# EAGLE design unonano (EAGLE 9.3.0)
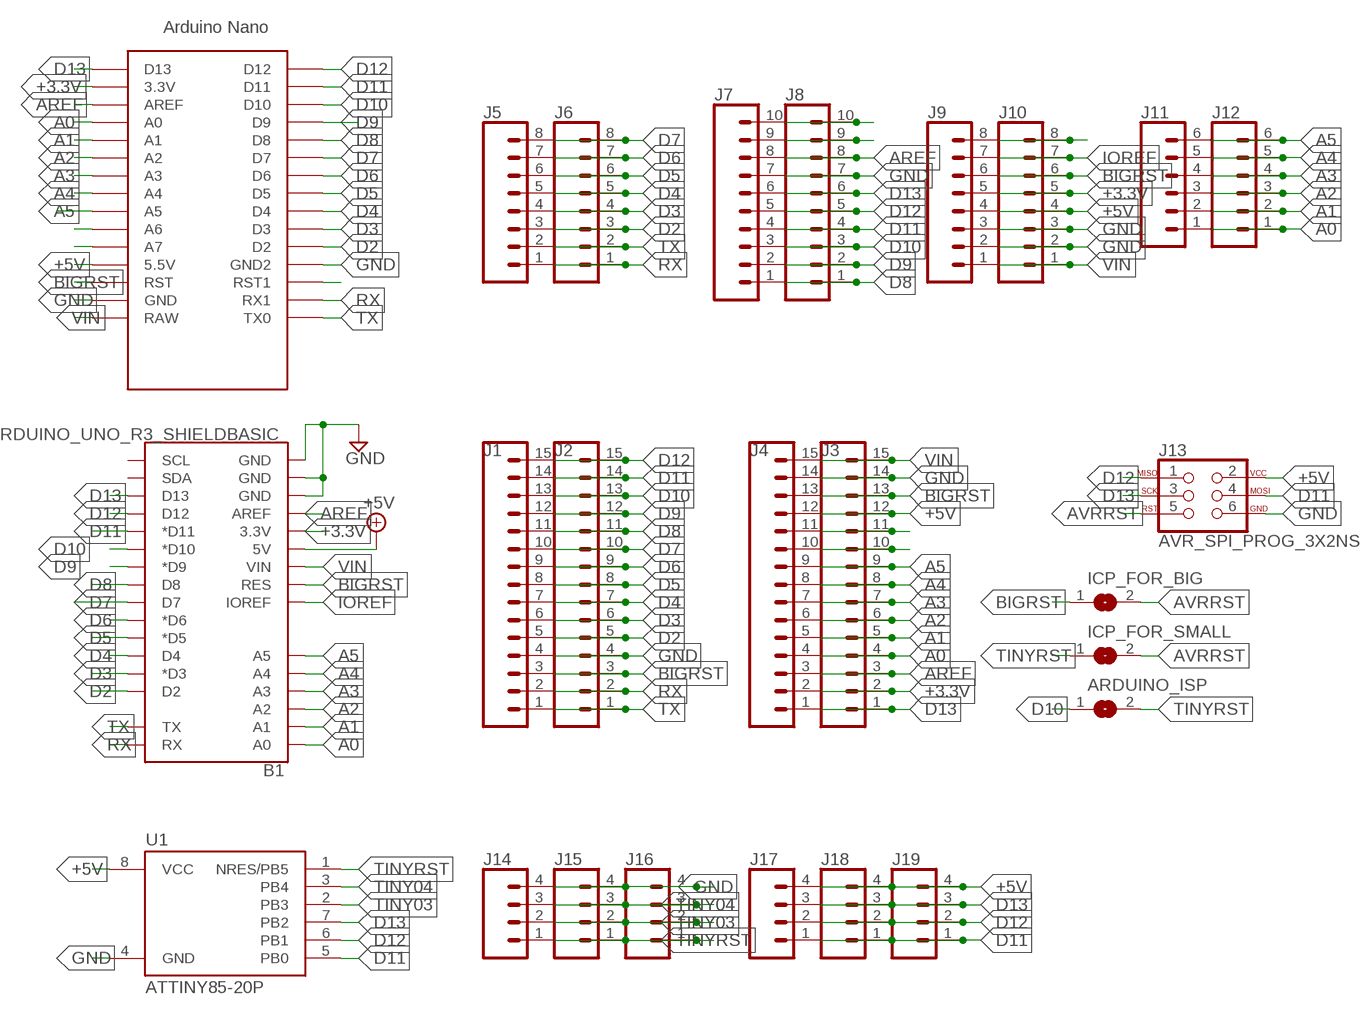
[diagram p0: schematic, sheet 1]

## Parts
ARDUINO_ISP  SJ  [SJ]
B1  ARDUINO_UNO_R3_SHIELDBASIC  [UNO_R3_SHIELD]
ICP_FOR_BIG  SJ  [SJ]
ICP_FOR_SMALL  SJ  [SJ]
J1  CONN_15  [1X15]
J2  CONN_15  [1X15]
J3  CONN_15  [1X15]
J4  CONN_15  [1X15]
J5  CONN_08"  [1X08]
J6  CONN_08"  [1X08]
J7  CONN_10"  [1X10]
J8  CONN_10"  [1X10]
J9  CONN_08"  [1X08]
J10  CONN_08"  [1X08]
J11  CONN_06SILK_FEMALE_PTH  [1X06]
J12  CONN_06SILK_FEMALE_PTH  [1X06]
J13  AVR_SPI_PROG_3X2NS  [2X3-NS]
J14  CONN_04  [1X04]
J15  CONN_04  [1X04]
J16  CONN_04  [1X04]
J17  CONN_04  [1X04]
J18  CONN_04  [1X04]
J19  CONN_04  [1X04]
U1  ATTINY85-20P  [PDIP08_300MIL]
U$1  NANO  [NANO]

## Nets
+3.3V: B1.3.3V J3.2 J4.2 J9.5 J10.5 U$1.3.3V
+5V: B1.5V J3.12 J4.12 J9.4 J10.4 J13.2 J17.4 J18.4 J19.4 U1.8(VCC) U$1.5V(5.5V)
A0: B1.A0 J3.4 J4.4 J11.1 J12.1 U$1.A0
A1: B1.A1 J3.5 J4.5 J11.2 J12.2 U$1.A1
A2: B1.A2 J3.6 J4.6 J11.3 J12.3 U$1.A2
A3: B1.A3 J3.7 J4.7 J11.4 J12.4 U$1.A3
A4: B1.A4 J3.8 J4.8 J11.5 J12.5 U$1.A4
A5: B1.A5 J3.9 J4.9 J11.6 J12.6 U$1.A5
AREF: B1.AREF J3.3 J4.3 J7.8 J8.8 U$1.AREF
AVRRST: ICP_FOR_BIG.2 ICP_FOR_SMALL.2 J13.5
BIGRST: B1.RES ICP_FOR_BIG.1 J1.3 J2.3 J3.13 J4.13 J9.6 J10.6 U$1.RST
D2: B1.D2 J1.5 J2.5 J5.3 J6.3 U$1.D2
D3: B1.D3(*D3) J1.6 J2.6 J5.4 J6.4 U$1.D3
D4: B1.D4 J1.7 J2.7 J5.5 J6.5 U$1.D4
D5: B1.D5(*D5) J1.8 J2.8 J5.6 J6.6 U$1.D5
D6: B1.D6(*D6) J1.9 J2.9 J5.7 J6.7 U$1.D6
D7: B1.D7 J1.10 J2.10 J5.8 J6.8 U$1.D7
D8: B1.D8 J1.11 J2.11 J7.1 J8.1 U$1.D8
D9: B1.D9(*D9) J1.12 J2.12 J7.2 J8.2 U$1.D9
D10: ARDUINO_ISP.1 B1.D10(*D10) J1.13 J2.13 J7.3 J8.3 U$1.D10
D11: B1.D11(*D11) J1.14 J2.14 J7.4 J8.4 J13.4 J17.1 J18.1 J19.1 U1.5(PB0) U$1.D11
D12: B1.D12 J1.15 J2.15 J7.5 J8.5 J13.1 J17.2 J18.2 J19.2 U1.6(PB1) U$1.D12
D13: B1.D13 J3.1 J4.1 J7.6 J8.6 J13.3 J17.3 J18.3 J19.3 U1.7(PB2) U$1.D13
GND: B1.GND@0(GND) B1.GND@1(GND) B1.GND@2(GND) J1.4 J2.4 J3.14 J4.14 J7.7 J8.7 J9.2 J9.3 J10.2 J10.3 J13.6 J14.4 J15.4 J16.4 U1.4(GND) U$1.GND U$1.GND1(GND2)
IOREF: B1.IOREF J9.7 J10.7
N$1: J9.8 J10.8
N$5: J3.11 J4.11
N$6: J3.10 J4.10
N$11: U$1.A6
N$12: U$1.A7
N$14: J7.9 J8.9
N$15: J7.10 J8.10
N$21: U$1.RST1
RX: B1.RX J1.2 J2.2 J5.1 J6.1 U$1.RX1
TINY03: J14.2 J15.2 J16.2 U1.2(PB3)
TINY04: J14.3 J15.3 J16.3 U1.3(PB4)
TINYRST: ARDUINO_ISP.2 ICP_FOR_SMALL.1 J14.1 J15.1 J16.1 U1.1(NRES/PB5)
TX: B1.TX J1.1 J2.1 J5.2 J6.2 U$1.TX0
VIN: B1.VIN J3.15 J4.15 J9.1 J10.1 U$1.RAW
Unconnected: B1.SCL B1.SDA U$1.ICSP1 U$1.ICSP2 U$1.ICSP3 U$1.ICSP4 U$1.ICSP5 U$1.ICSP6

## Library data of the parts
ARDUINO_ISP ICP_FOR_BIG ICP_FOR_SMALL = jumper:SJ: SMD solder JUMPER
B1 = SparkFun-Boards:ARDUINO_UNO_R3_SHIELD: Arduino R3 Shield Footprint Shield form compatible with the Arduino Uno R3. SparkFun Products: MG2639 Cellular Shield <https://www.sparkfun.com/products/13120> MIDI Shield <https://www.sparkfun.com/products/12898> R3 Stackable Headers Kit <https://www.sparkfun.com/products/11417>
J1-J4 = SparkFun-Connectors:CONN_15: Multi connection point. Often used as Generic Header-pin footprint for 0.1 inch spaced/style header connections On any of the 0.1 inch spaced packages, you can populate with these: Break Away Headers - Straight <https://www.sparkfun.com/products/116> (PRT-00116) Break Away Male Headers - Right Angle <https://www.sparkfun.com/products/553> (PRT-00553) Female Headers <https://www.sparkfun.com/products/115> (PRT-00115) Break Away Headers - Machine Pin <https://www.sparkfun.com/products/117> (PRT-00117) Break Away Female Headers - Swiss Machine Pin <https://www.sparkfun.com/products/743> (PRT-00743) For SCREWTERMINALS and SPRING TERMINALS visit here: Screw Terimnals on SparkFun.com <https://www.sparkfun.com/search/results?term=Screw+Terminals> (5mm/3.5mm/2.54mm spacing) This device is also useful as a general connection point to wire up your design to another part of your project. Our various solder wires solder well into these plated through hole pads. Hook-Up Wire - Assortment (Stranded, 22 AWG) <https://www.sparkfun.com/products/11375> (PRT-11375) Hook-Up Wire - Assortment (Solid Core, 22 AWG) <https://www.sparkfun.com/products/11367> (PRT-11367) View the entire wire category on our website here <https://www.sparkfun.com/categories/141> Special notes: Molex polarized connector foot print use with SKU : PRT-08231 with associated crimp pins and housings. 1MM SMD Version SKU: PRT-10208 NOTES ON THE VARIANTS LOCK and LOCK_LONGPADS... This footprint was designed to help hold the alignment of a through-hole component (i.e. 6-pin header) while soldering it into place. You may notice that each hole has been shifted either up or down by 0.005 of an inch from it's more standard position (which is a perfectly straight line). This slight alteration caused the pins (the squares in the middle) to touch the edges of the holes. Because they are alternating, it causes a "brace" to hold the component in place. 0.005 has proven to be the perfect amount of "off-center" position when using our standard breakaway headers. Although looks a little odd when you look at the bare footprint, once you have a header in there, the alteration is very hard to notice. Also,if you push a header all the way into place, it is covered up entirely on the bottom side.
J5 J6 J9 J10 = SparkFun-Connectors:CONN_08: Multi connection point. Often used as Generic Header-pin footprint for 0.1 inch spaced/style header connections On any of the 0.1 inch spaced packages, you can populate with these: Break Away Headers - Straight <https://www.sparkfun.com/products/116> (PRT-00116) Break Away Male Headers - Right Angle <https://www.sparkfun.com/products/553> (PRT-00553) Female Headers <https://www.sparkfun.com/products/115> (PRT-00115) Break Away Headers - Machine Pin <https://www.sparkfun.com/products/117> (PRT-00117) Break Away Female Headers - Swiss Machine Pin <https://www.sparkfun.com/products/743> (PRT-00743) Arduino Stackable Header - 8 Pin <https://www.sparkfun.com/products/9279> (PRT-09279) For SCREWTERMINALS and SPRING TERMINALS visit here: Screw Terimnals on SparkFun.com <https://www.sparkfun.com/search/results?term=Screw+Terminals> (5mm/3.5mm/2.54mm spacing) This device is also useful as a general connection point to wire up your design to another part of your project. Our various solder wires solder well into these plated through hole pads. Hook-Up Wire - Assortment (Stranded, 22 AWG) <https://www.sparkfun.com/products/11375> (PRT-11375) Hook-Up Wire - Assortment (Solid Core, 22 AWG) <https://www.sparkfun.com/products/11367> (PRT-11367) View the entire wire category on our website here <https://www.sparkfun.com/categories/141> Special notes: Molex polarized connector foot print use with SKU : PRT-08231 with associated crimp pins and housings. 1MM SMD Version SKU: PRT-10208 NOTES ON THE VARIANTS LOCK and LOCK_LONGPADS... This footprint was designed to help hold the alignment of a through-hole component (i.e. 6-pin header) while soldering it into place. You may notice that each hole has been shifted either up or down by 0.005 of an inch from it's more standard position (which is a perfectly straight line). This slight alteration caused the pins (the squares in the middle) to touch the edges of the holes. Because they are alternating, it causes a "brace" to hold the component in place. 0.005 has proven to be the perfect amount of "off-center" position when using our standard breakaway headers. Although looks a little odd when you look at the bare footprint, once you have a header in there, the alteration is very hard to notice. Also,if you push a header all the way into place, it is covered up entirely on the bottom side.; PROD_ID: CONN-08438
J7 J8 = SparkFun-Connectors:CONN_10: Multi connection point. Often used as Generic Header-pin footprint for 0.1 inch spaced/style header connections On any of the 0.1 inch spaced packages, you can populate with these: Break Away Headers - Straight <https://www.sparkfun.com/products/116> (PRT-00116) Break Away Male Headers - Right Angle <https://www.sparkfun.com/products/553> (PRT-00553) Female Headers <https://www.sparkfun.com/products/115> (PRT-00115) Break Away Headers - Machine Pin <https://www.sparkfun.com/products/117> (PRT-00117) Break Away Female Headers - Swiss Machine Pin <https://www.sparkfun.com/products/743> (PRT-00743) Arduino Stackable Header - 10 Pin <https://www.sparkfun.com/products/11376> (PRT-11376) For SCREWTERMINALS and SPRING TERMINALS visit here: Screw Terimnals on SparkFun.com <https://www.sparkfun.com/search/results?term=Screw+Terminals> (5mm/3.5mm/2.54mm spacing) This device is also useful as a general connection point to wire up your design to another part of your project. Our various solder wires solder well into these plated through hole pads. Hook-Up Wire - Assortment (Stranded, 22 AWG) <https://www.sparkfun.com/products/11375> (PRT-11375) Hook-Up Wire - Assortment (Solid Core, 22 AWG) <https://www.sparkfun.com/products/11367> (PRT-11367) View the entire wire category on our website here <https://www.sparkfun.com/categories/141> Special notes: Molex polarized connector foot print use with SKU : PRT-08231 with associated crimp pins and housings. 1MM SMD Version SKU: PRT-10208 NOTES ON THE VARIANTS LOCK and LOCK_LONGPADS... This footprint was designed to help hold the alignment of a through-hole component (i.e. 6-pin header) while soldering it into place. You may notice that each hole has been shifted either up or down by 0.005 of an inch from it's more standard position (which is a perfectly straight line). This slight alteration caused the pins (the squares in the middle) to touch the edges of the holes. Because they are alternating, it causes a "brace" to hold the component in place. 0.005 has proven to be the perfect amount of "off-center" position when using our standard breakaway headers. Although looks a little odd when you look at the bare footprint, once you have a header in there, the alteration is very hard to notice. Also,if you push a header all the way into place, it is covered up entirely on the bottom side.; PROD_ID: CONN-11563
J11 J12 = SparkFun-Connectors:CONN_06: Multi connection point. Often used as Generic Header-pin footprint for 0.1 inch spaced/style header connections On any of the 0.1 inch spaced packages, you can populate with these: Break Away Headers - Straight <https://www.sparkfun.com/products/116> (PRT-00116) Break Away Male Headers - Right Angle <https://www.sparkfun.com/products/553> (PRT-00553) Female Headers <https://www.sparkfun.com/products/115> (PRT-00115) Break Away Headers - Machine Pin <https://www.sparkfun.com/products/117> (PRT-00117) Break Away Female Headers - Swiss Machine Pin <https://www.sparkfun.com/products/743> (PRT-00743) Arduino Stackable Header - 6 Pin <https://www.sparkfun.com/products/9280> (PRT-09280) For SCREWTERMINALS and SPRING TERMINALS visit here: Screw Terimnals on SparkFun.com <https://www.sparkfun.com/search/results?term=Screw+Terminals> (5mm/3.5mm/2.54mm spacing) This device is also useful as a general connection point to wire up your design to another part of your project. Our various solder wires solder well into these plated through hole pads. Hook-Up Wire - Assortment (Stranded, 22 AWG) <https://www.sparkfun.com/products/11375> (PRT-11375) Hook-Up Wire - Assortment (Solid Core, 22 AWG) <https://www.sparkfun.com/products/11367> (PRT-11367) View the entire wire category on our website here <https://www.sparkfun.com/categories/141>; PROD_ID: CONN-08437
J13 = SparkFun-Connectors:AVR_SPI_PROG_3X2: AVR ISP 6 Pin This is the reduced ISP connector for AVR programming. Common on Arduino. This footprint will take up less PCB space and can be used with a 10-pin to 6-pin adapter such as SKU: BOB-08508 **Special note about "TEST_POINT" package. The stop mask is on the top side, so if you want your programming test points to be on the bottom of your board, make sure to place this package on the bottom side of the board. This also ensure that the orientation to program from the bottom side will be correct. SparkFun Products: SparkFun ISP Pogo Adapter <https://www.sparkfun.com/products/11591> - NS Tiny AVR Programmer <https://www.sparkfun.com/products/11801> -PTH
J14-J19 = SparkFun-Connectors:CONN_04: Multi connection point. Often used as Generic Header-pin footprint for 0.1 inch spaced/style header connections On any of the 0.1 inch spaced packages, you can populate with these: Break Away Headers - Straight <https://www.sparkfun.com/products/116> (PRT-00116) Break Away Male Headers - Right Angle <https://www.sparkfun.com/products/553> (PRT-00553) Female Headers <https://www.sparkfun.com/products/115> (PRT-00115) Break Away Headers - Machine Pin <https://www.sparkfun.com/products/117> (PRT-00117) Break Away Female Headers - Swiss Machine Pin <https://www.sparkfun.com/products/743> (PRT-00743) For SCREWTERMINALS and SPRING TERMINALS visit here: Screw Terimnals on SparkFun.com <https://www.sparkfun.com/search/results?term=Screw+Terminals> (5mm/3.5mm/2.54mm spacing) This device is also useful as a general connection point to wire up your design to another part of your project. Our various solder wires solder well into these plated through hole pads. Hook-Up Wire - Assortment (Stranded, 22 AWG) <https://www.sparkfun.com/products/11375> (PRT-11375) Hook-Up Wire - Assortment (Solid Core, 22 AWG) <https://www.sparkfun.com/products/11367> (PRT-11367) View the entire wire category on our website here <https://www.sparkfun.com/categories/141> Special notes: Molex polarized connector foot print use with SKU : PRT-08231 with associated crimp pins and housings. 1MM SMD Version SKU: PRT-10208; PROD_ID: CONN-09696
U1 = _hhn_attiny25_45_85:ATTINY85*: ATMEL ATtiny 85 Packages: P = PDIP 08 30mil S = SOIC 08 EIAJ 208mil Technologies Note: for complete ordering code (temp. range, finish, tape&reel etc.) see www.atmel.com • Supply Voltage: V = (1.8…5.5)V | [blank] = (2.7…5.5)V • Speed: 10 = 10 MHz | 20 = 20 MHz Author: Dipl.-Ing. FH Rainer Bayer HHN Hochschule Heilbronn (Heilbronn University), rainer.bayer@hs-heilbronn.de Ingenieurbüro ing-rb, mail@ing-rb.de
U$1 = Arduino-clone:NANO: Arduino Nano

## Board
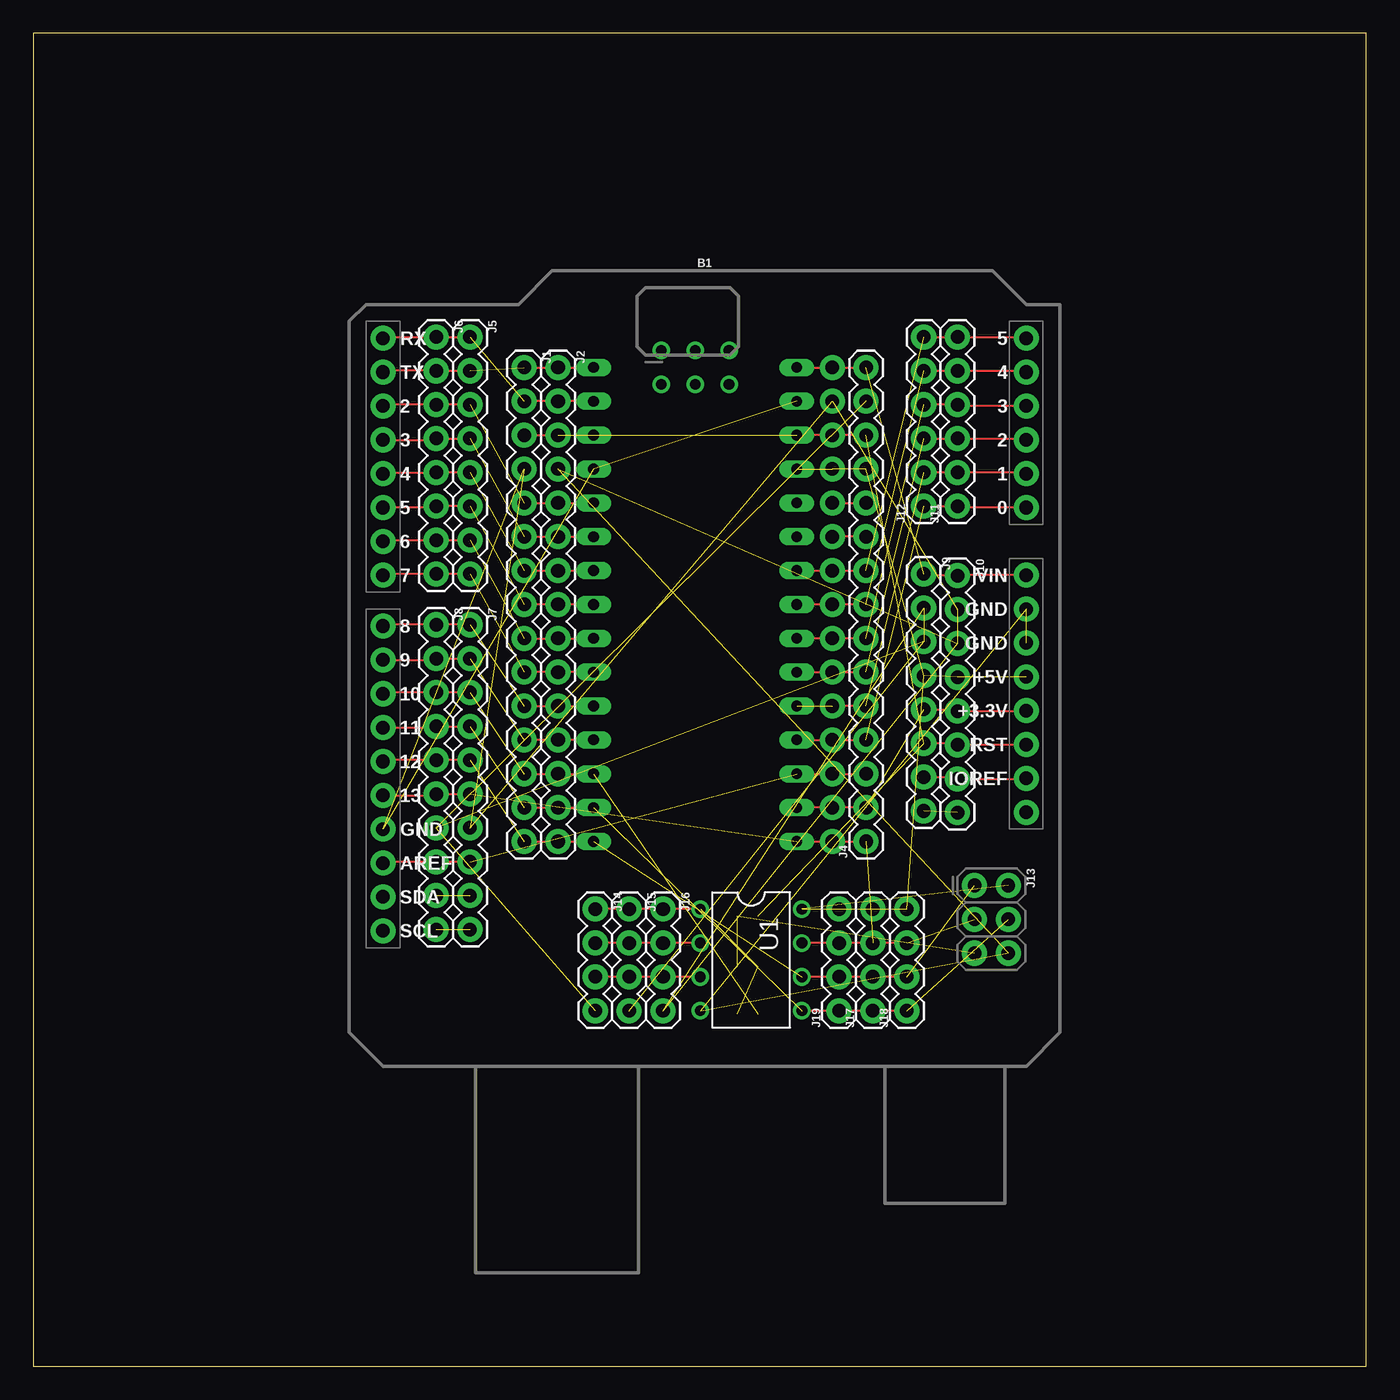
[diagram p1: board, top side]
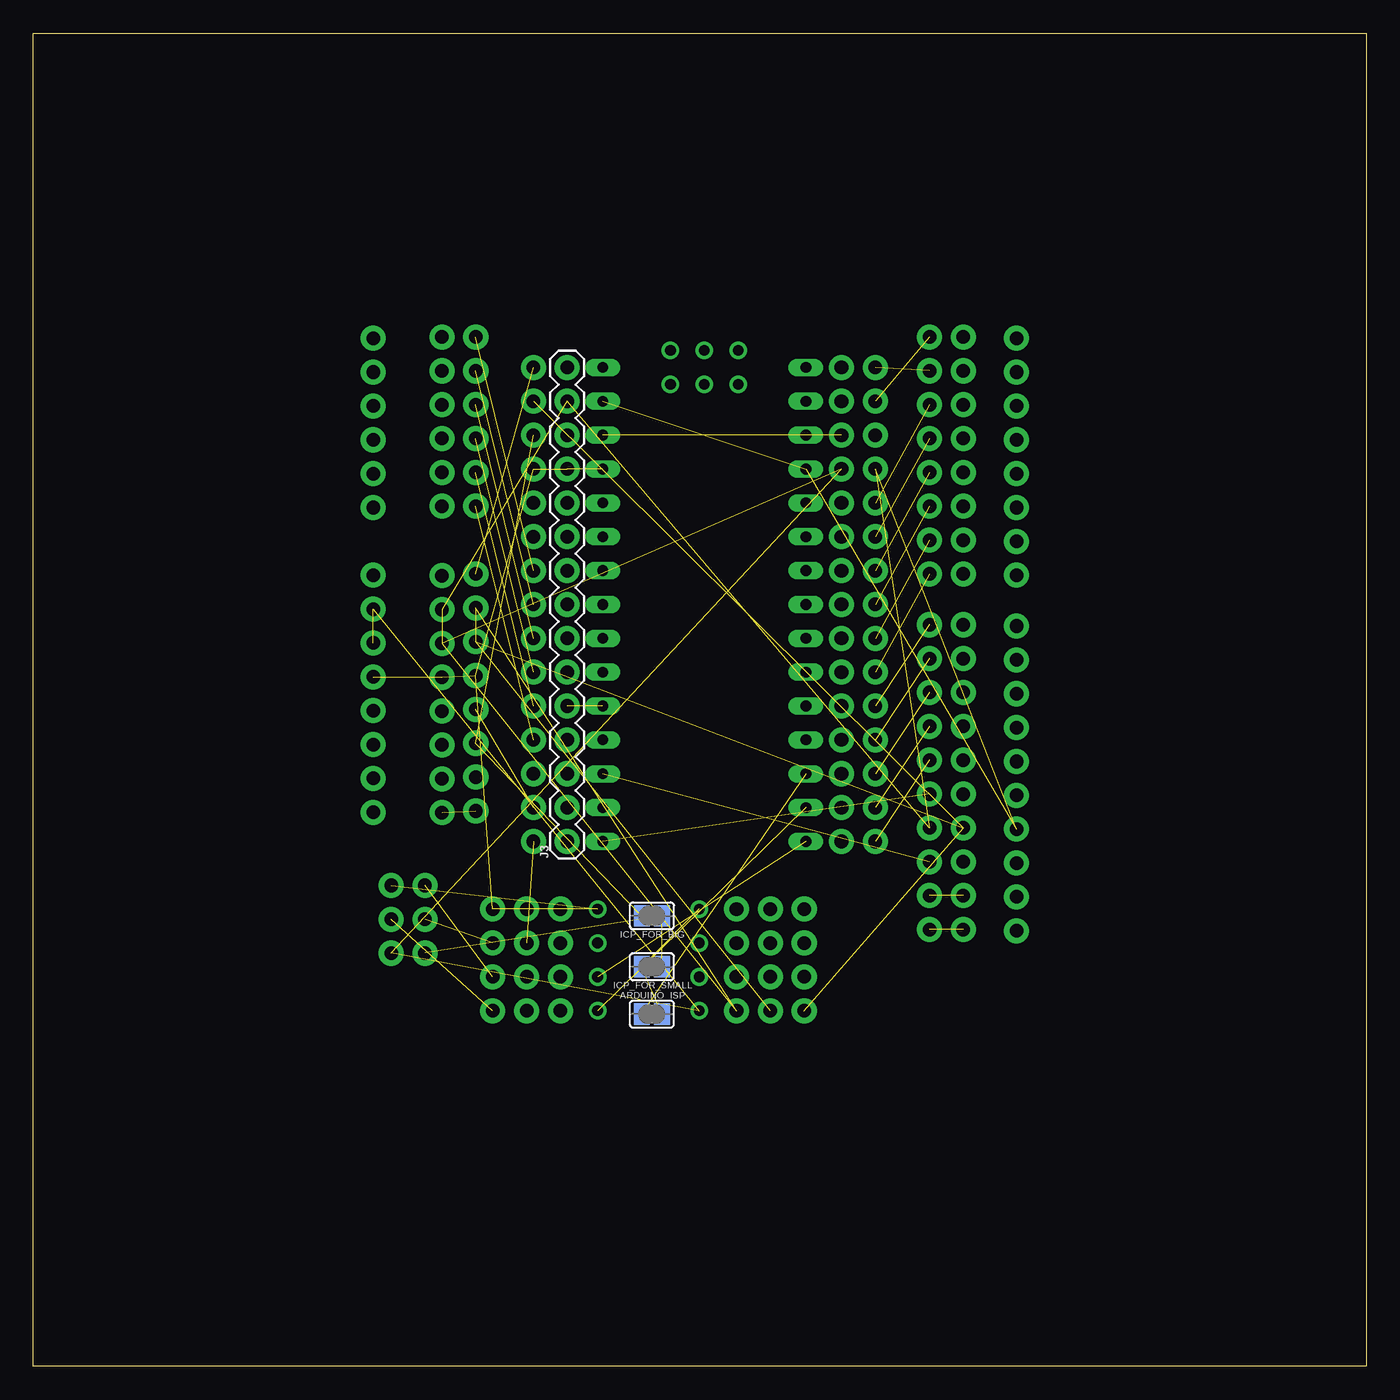
[diagram p2: board, bottom side, seen from below]

Size 100 x 100 mm. Coordinates in mm from the lower left corner, seen from the top.
Outline: 0,0 100,0 100,100 0,100 0,0
Copper layers (1*16): Top 0.035mm / dielectric 1.5mm / Bottom 0.035mm
Design rules "default": minimum track width 6mil, minimum drill 0.35mm, track to track 6mil, track to pad 6mil, pad to pad 6mil, via to via 6mil, smd to smd 6mil, copper to edge 40mil, drill to drill 6mil, minimum pad ring 10mil, minimum via ring 8mil, stop-mask expansion 4mil, vias tented up to drill 0mil, thermal gap 10mil

### Footprints (pad centres in the part's own frame; a part is rotated, then mirrored left to right if it is on the bottom)
SJ = smd 1.168 x 1.6: 1 -0.762,0; 2 0.762,0
UNO_R3_SHIELD = drill 1.016 pad 1.88: 3.3V 24.13,-2.54; 5V 24.13,0; A0 24.13,12.7; A1 24.13,15.24; A2 24.13,17.78; A3 24.13,20.32; A4 24.13,22.86; A5 24.13,25.4; AREF -24.13,-13.97; D2 -24.13,20.32; D3 -24.13,17.78; D4 -24.13,15.24; D5 -24.13,12.7; D6 -24.13,10.16; D7 -24.13,7.62; D8 -24.13,3.81; D9 -24.13,1.27; D10 -24.13,-1.27; D11 -24.13,-3.81; D12 -24.13,-6.35; D13 -24.13,-8.89; GND@0 24.13,2.54; GND@1 24.13,5.08; GND@2 -24.13,-11.43; IOREF 24.13,-7.62; NC 24.13,-10.16; RES 24.13,-5.08; RX -24.13,25.4; SCL -24.13,-19.05; SDA -24.13,-16.51; TX -24.13,22.86; VIN 24.13,7.62
1X15 = drill 1.016 pad 1.88: 1 0,0; 2 2.54,0; 3 5.08,0; 4 7.62,0; 5 10.16,0; 6 12.7,0; 7 15.24,0; 8 17.78,0; 9 20.32,0; 10 22.86,0; 11 25.4,0; 12 27.94,0; 13 30.48,0; 14 33.02,0; 15 35.56,0
1X08 = drill 1.016 pad 1.88: 1 0,0; 2 2.54,0; 3 5.08,0; 4 7.62,0; 5 10.16,0; 6 12.7,0; 7 15.24,0; 8 17.78,0
1X10 = drill 1.016 pad 1.88: 1 0,0; 2 2.54,0; 3 5.08,0; 4 7.62,0; 5 10.16,0; 6 12.7,0; 7 15.24,0; 8 17.78,0; 9 20.32,0; 10 22.86,0
1X06 = drill 1.016 pad 1.88: 1 0,0; 2 2.54,0; 3 5.08,0; 4 7.62,0; 5 10.16,0; 6 12.7,0
2X3-NS = drill 1.016 pad 1.88: 1 -2.54,-1.27; 2 -2.54,1.27; 3 0,-1.27; 4 0,1.27; 5 2.54,-1.27; 6 2.54,1.27
1X04 = drill 1.016 pad 1.88: 1 0,0; 2 2.54,0; 3 5.08,0; 4 7.62,0
PDIP08_300MIL = drill 0.813: 1 -3.81,-3.81; 2 -1.27,-3.81; 3 1.27,-3.81; 4 3.81,-3.81; 5 3.81,3.81; 6 1.27,3.81; 7 -1.27,3.81; 8 -3.81,3.81
NANO = drill 0.8 long: 3.3V -10.16,24.13; 5V -10.16,-1.27; A0 -10.16,19.05; A1 -10.16,16.51; A2 -10.16,13.97; A3 -10.16,11.43; A4 -10.16,8.89; A5 -10.16,6.35; A6 -10.16,3.81; A7 -10.16,1.27; AREF -10.16,21.59; D2 5.08,1.27; D3 5.08,3.81; D4 5.08,6.35; D5 5.08,8.89; D6 5.08,11.43; D7 5.08,13.97; D8 5.08,16.51; D9 5.08,19.05; D10 5.08,21.59; D11 5.08,24.13; D12 5.08,26.67; D13 -10.16,26.67; GND -10.16,-6.35; GND1 5.08,-1.27; RAW -10.16,-8.89; RST -10.16,-3.81; RST1 5.08,-3.81; RX1 5.08,-6.35; TX0 5.08,-8.89 | drill 0.8: ICSP1 -5.08,-10.16; ICSP2 -5.08,-7.62; ICSP3 -2.54,-10.16; ICSP4 -2.54,-7.62; ICSP5 0,-10.16; ICSP6 0,-7.62

### Placement (x,y rotation side)
ARDUINO_ISP  53.59,26.42 0 bottom
B1  50.36,51.72 0 top
ICP_FOR_BIG  53.59,33.78 0 bottom
ICP_FOR_SMALL  53.59,29.97 0 bottom
J1  36.83,74.93 270 top
J2  39.37,74.93 270 top
J3  59.94,39.37 90 bottom
J4  62.48,39.37 90 top
J5  32.77,77.22 270 top
J6  30.23,77.22 270 top
J7  32.77,55.63 270 top
J8  30.23,55.63 270 top
J9  66.8,59.44 270 top
J10  69.34,59.31 270 top
J11  69.34,64.52 90 top
J12  66.8,64.52 90 top
J13  71.88,33.53 270 top
J14  42.16,34.29 270 top
J15  44.7,34.29 270 top
J16  47.24,34.29 270 top
J17  62.99,26.67 90 top
J18  65.53,26.67 90 top
J19  60.45,26.67 90 top
U1  53.85,30.48 270 top
U$1  47.12,66.04 180 top

### Tracks (layer width: path | path; a pad name or v marks a point on that pad's centre or on a via)
+3.3V  (1 unrouted)
  Top 0.152: J4.2 J3.2 U$1.3.3V | J9.5 69.22,49.28 J10.5 74.46,49.15 B1.3.3V
+5V  (10 unrouted)
A0  (1 unrouted)
  Top 0.152: U$1.A0 J3.4 J4.4 | J12.1 J11.1 69.44,64.42 B1.A0
A1  (2 unrouted)
  Top 0.152: J4.5 J3.5 | B1.A1 74.39,67.06 J11.2 J12.2
A2  (1 unrouted)
  Top 0.152: U$1.A2 J3.6 J4.6 | J12.3 J11.3 74.39,69.6 B1.A2
A3  (1 unrouted)
  Top 0.152: J4.7 J3.7 U$1.A3 | B1.A3 69.44,72.04 J11.4 J12.4
A4  (1 unrouted)
  Top 0.152: J4.8 J3.8 U$1.A4 | J12.5 J11.5 74.39,74.68 B1.A4
A5  (1 unrouted)
  Top 0.152: U$1.A5 J3.9 J4.9 | J12.6 J11.6 74.39,77.22 B1.A5
AREF  (1 unrouted)
  Top 0.152: U$1.AREF J3.3 J4.3 | J7.8 J8.8 26.33,37.85 B1.AREF
AVRRST  (2 unrouted)
BIGRST  (3 unrouted)
  Top 0.152: J1.3 J2.3 | J4.13 J3.13 U$1.RST | B1.RES 74.46,46.61 J10.6 69.22,46.74 J9.6
D2  (1 unrouted)
  Top 0.152: J1.5 J2.5 U$1.D2 | J5.3 J6.3 26.33,72.14 B1.D2
D3  (1 unrouted)
  Top 0.152: J1.6 J2.6 U$1.D3 | B1.D3 30.13,69.5 J6.4 J5.4
D4  (1 unrouted)
  Top 0.152: J1.7 J2.7 U$1.D4 | J5.5 30.48,67.06 J6.5 26.33,67.06 B1.D4
D5  (1 unrouted)
  Top 0.152: U$1.D5 J2.8 J1.8 | J5.6 J6.6 30.13,64.42 B1.D5
D6  (1 unrouted)
  Top 0.152: J1.9 J2.9 U$1.D6 | B1.D6 26.33,61.98 J6.7 J5.7
D7  (1 unrouted)
  Top 0.152: U$1.D7 J2.10 J1.10 | J5.8 J6.8 26.33,59.44 B1.D7
D8  (1 unrouted)
  Top 0.152: J1.11 J2.11 U$1.D8 | J7.1 J8.1 26.33,55.63 B1.D8
D9  (1 unrouted)
  Top 0.152: U$1.D9 J2.12 J1.12 | B1.D9 30.13,52.99 J8.2 J7.2
D10  (2 unrouted)
  Top 0.152: J1.13 J2.13 U$1.D10 | J7.3 J8.3 26.33,50.55 B1.D10
D11  (3 unrouted)
  Top 0.152: J18.1 J17.1 J19.1 U1.5 | J1.14 J2.14 U$1.D11 | B1.D11 30.13,47.91 J8.4 J7.4
D12  (3 unrouted)
  Top 0.152: J18.2 J17.2 J19.2 U1.6 | J1.15 J2.15 U$1.D12 | J7.5 J8.5 26.33,45.47 B1.D12
D13  (3 unrouted)
  Top 0.152: J18.3 J17.3 J19.3 U1.7 | U$1.D13 J3.1 J4.1 | B1.D13 30.13,42.83 J8.6 J7.6
GND  (19 unrouted)
IOREF
  Top 0.152: J9.7 69.22,44.2 J10.7 74.46,44.07 B1.IOREF
N$1  (1 unrouted)
N$5
  Top 0.152: J3.11 J4.11
N$6
  Top 0.152: J4.10 J3.10
N$14  (1 unrouted)
N$15  (1 unrouted)
RX  (1 unrouted)
  Top 0.152: U$1.RX1 J2.2 J1.2 | B1.RX 26.33,77.22 J6.1 J5.1
TINY03
  Top 0.152: U1.2 J16.2 J15.2 J14.2
TINY04
  Top 0.152: U1.3 J16.3 J15.3 J14.3
TINYRST  (2 unrouted)
  Top 0.152: U1.1 J16.1 J15.1 J14.1
TX  (1 unrouted)
  Top 0.152: J1.1 J2.1 U$1.TX0 | B1.TX 26.33,74.68 J6.2 J5.2
VIN  (1 unrouted)
  Top 0.152: U$1.RAW J3.15 J4.15 | B1.VIN 69.37,59.34 J10.1 66.93,59.31 J9.1